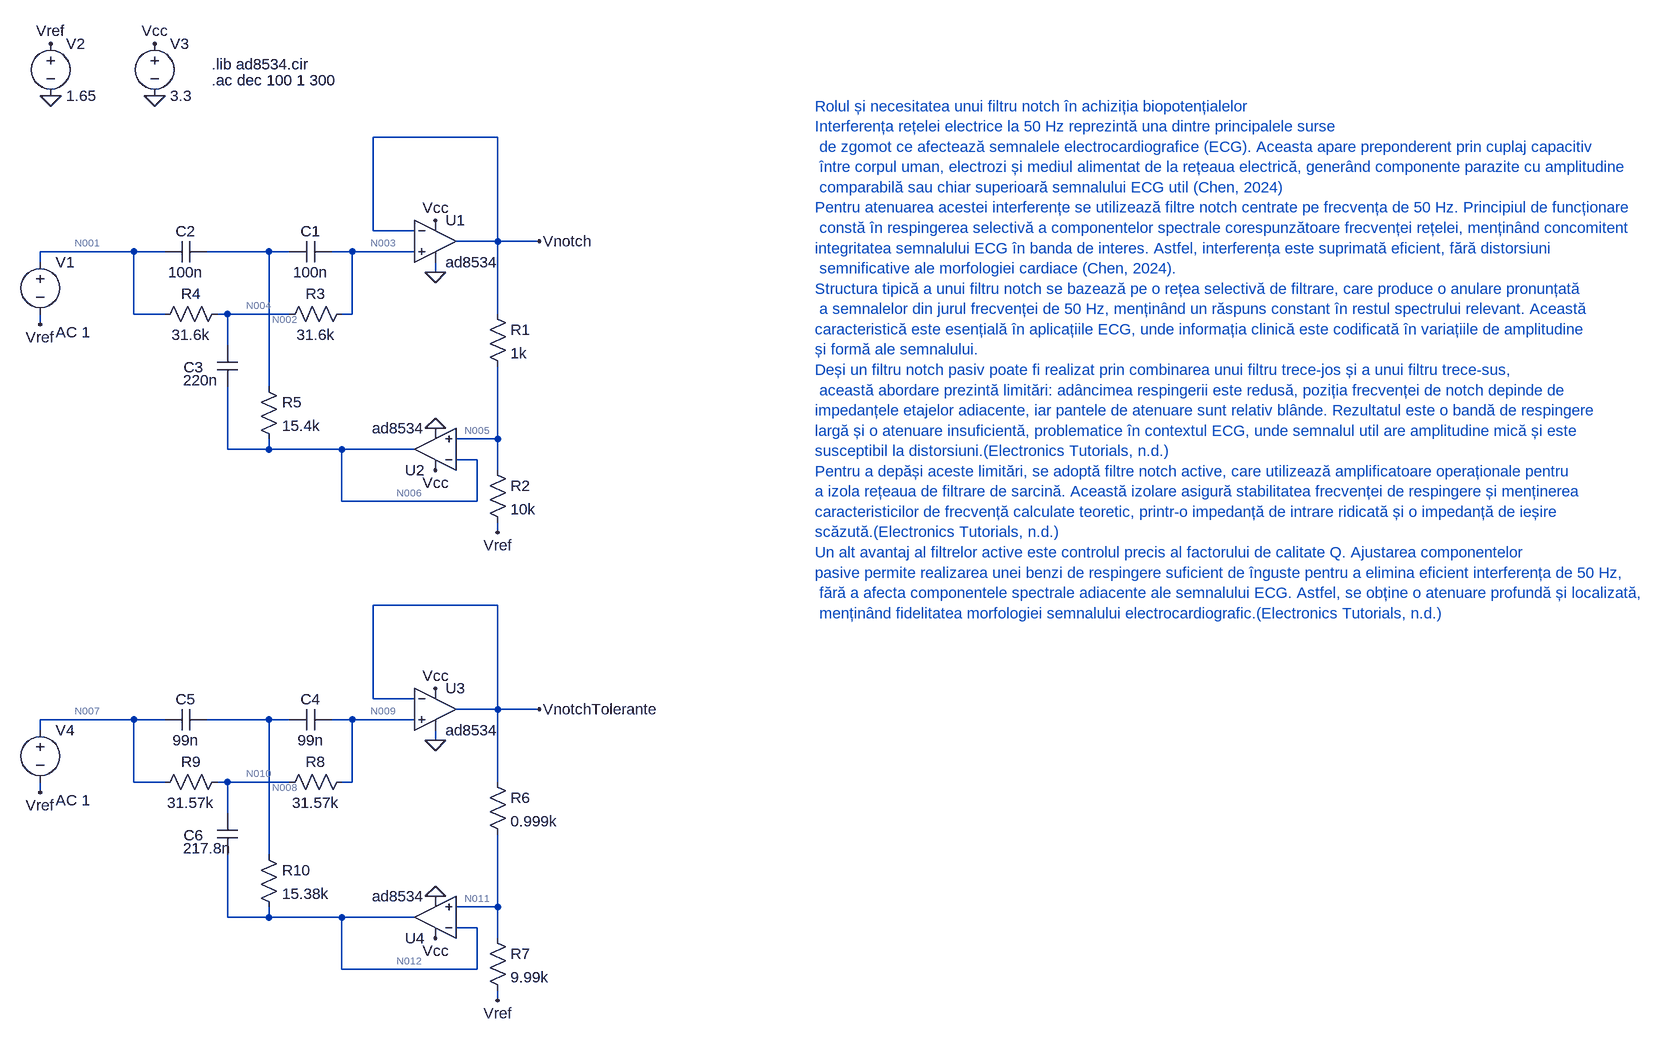
[diagram p0: schematic Notch.asc]
Notch.asc, the LTspice schematic file:
Version 4.1
SHEET 1 2208 1344
WIRE 512 -64 320 -64
WIRE 320 80 320 -64
WIRE 384 80 320 80
WIRE 512 96 512 -64
WIRE 512 96 448 96
WIRE 576 96 512 96
WIRE -48 112 -192 112
WIRE 0 112 -48 112
WIRE 160 112 64 112
WIRE 192 112 160 112
WIRE 288 112 256 112
WIRE 384 112 288 112
WIRE -192 128 -192 112
WIRE 416 144 416 128
WIRE -48 208 -48 112
WIRE 0 208 -48 208
WIRE 96 208 80 208
WIRE 192 208 96 208
WIRE 288 208 288 112
WIRE 288 208 272 208
WIRE 512 208 512 96
WIRE -192 224 -192 208
WIRE 96 256 96 208
WIRE 160 320 160 112
WIRE 512 400 512 288
WIRE 512 400 448 400
WIRE 96 416 96 320
WIRE 160 416 160 400
WIRE 160 416 96 416
WIRE 272 416 160 416
WIRE 384 416 272 416
WIRE 480 432 448 432
WIRE 512 448 512 400
WIRE 272 496 272 416
WIRE 480 496 480 432
WIRE 480 496 272 496
WIRE 512 544 512 528
WIRE 512 656 320 656
WIRE 320 800 320 656
WIRE 384 800 320 800
WIRE 512 816 512 656
WIRE 512 816 448 816
WIRE 576 816 512 816
WIRE -48 832 -192 832
WIRE 0 832 -48 832
WIRE 160 832 64 832
WIRE 192 832 160 832
WIRE 288 832 256 832
WIRE 384 832 288 832
WIRE -192 848 -192 832
WIRE 416 864 416 848
WIRE -48 928 -48 832
WIRE 0 928 -48 928
WIRE 96 928 80 928
WIRE 192 928 96 928
WIRE 288 928 288 832
WIRE 288 928 272 928
WIRE 512 928 512 816
WIRE -192 944 -192 928
WIRE 96 976 96 928
WIRE 160 1040 160 832
WIRE 512 1120 512 1008
WIRE 512 1120 448 1120
WIRE 96 1136 96 1040
WIRE 160 1136 160 1120
WIRE 160 1136 96 1136
WIRE 272 1136 160 1136
WIRE 384 1136 272 1136
WIRE 480 1152 448 1152
WIRE 512 1168 512 1120
WIRE 272 1216 272 1136
WIRE 480 1216 480 1152
WIRE 480 1216 272 1216
WIRE 512 1264 512 1248
FLAG 416 144 0
FLAG 416 64 Vcc
FLAG 576 96 Vnotch
FLAG 416 448 Vcc
FLAG 416 384 0
FLAG -176 -208 Vref
FLAG -176 -128 0
FLAG -16 -128 0
FLAG -16 -208 Vcc
FLAG 512 544 Vref
FLAG -192 224 Vref
FLAG 416 864 0
FLAG 416 784 Vcc
FLAG 576 816 VnotchTolerante
FLAG 416 1168 Vcc
FLAG 416 1104 0
FLAG 512 1264 Vref
FLAG -192 944 Vref
SYMBOL OpAmps\\opamp2 416 32 R0
SYMATTR InstName U1
SYMATTR Value ad8534
SYMBOL res 496 192 R0
SYMATTR InstName R1
SYMATTR Value 1k
SYMBOL res 496 432 R0
SYMATTR InstName R2
SYMATTR Value 10k
SYMBOL cap 256 96 R90
WINDOW 0 0 32 VBottom 2
WINDOW 3 32 32 VTop 2
SYMATTR InstName C1
SYMATTR Value 100n
SYMBOL cap 64 96 R90
WINDOW 0 0 32 VBottom 2
WINDOW 3 32 32 VTop 2
SYMATTR InstName C2
SYMATTR Value 100n
SYMBOL res 288 192 R90
WINDOW 0 0 56 VBottom 2
WINDOW 3 32 56 VTop 2
SYMATTR InstName R3
SYMATTR Value 31.6k
SYMBOL res 96 192 R90
WINDOW 0 0 56 VBottom 2
WINDOW 3 32 56 VTop 2
SYMATTR InstName R4
SYMATTR Value 31.6k
SYMBOL cap 80 256 R0
WINDOW 0 -51 34 Left 2
WINDOW 3 -52 54 Left 2
SYMATTR InstName C3
SYMATTR Value 220n
SYMBOL res 144 304 R0
SYMATTR InstName R5
SYMATTR Value 15.4k
SYMBOL OpAmps\\opamp2 416 480 R180
SYMATTR InstName U2
SYMATTR Value ad8534
SYMBOL voltage -192 112 R0
WINDOW 123 24 124 Left 2
WINDOW 39 0 0 Left 0
SYMATTR Value2 AC 1
SYMATTR InstName V1
SYMATTR Value ""
SYMBOL voltage -176 -224 R0
WINDOW 123 0 0 Left 0
WINDOW 39 0 0 Left 0
SYMATTR InstName V2
SYMATTR Value 1.65
SYMBOL voltage -16 -224 R0
SYMATTR InstName V3
SYMATTR Value 3.3
SYMBOL OpAmps\\opamp2 416 752 R0
SYMATTR InstName U3
SYMATTR Value ad8534
SYMBOL res 496 912 R0
SYMATTR InstName R6
SYMATTR Value 0.999k
SYMBOL res 496 1152 R0
SYMATTR InstName R7
SYMATTR Value 9.99k
SYMBOL cap 256 816 R90
WINDOW 0 0 32 VBottom 2
WINDOW 3 32 32 VTop 2
SYMATTR InstName C4
SYMATTR Value 99n
SYMBOL cap 64 816 R90
WINDOW 0 0 32 VBottom 2
WINDOW 3 32 32 VTop 2
SYMATTR InstName C5
SYMATTR Value 99n
SYMBOL res 288 912 R90
WINDOW 0 0 56 VBottom 2
WINDOW 3 32 56 VTop 2
SYMATTR InstName R8
SYMATTR Value 31.57k
SYMBOL res 96 912 R90
WINDOW 0 0 56 VBottom 2
WINDOW 3 32 56 VTop 2
SYMATTR InstName R9
SYMATTR Value 31.57k
SYMBOL cap 80 976 R0
WINDOW 0 -51 34 Left 2
WINDOW 3 -52 54 Left 2
SYMATTR InstName C6
SYMATTR Value 217.8n
SYMBOL res 144 1024 R0
SYMATTR InstName R10
SYMATTR Value 15.38k
SYMBOL OpAmps\\opamp2 416 1200 R180
SYMATTR InstName U4
SYMATTR Value ad8534
SYMBOL voltage -192 832 R0
WINDOW 123 24 124 Left 2
WINDOW 39 0 0 Left 0
SYMATTR Value2 AC 1
SYMATTR InstName V4
SYMATTR Value ""
TEXT 72 -152 Left 2 !.ac dec 100 1 300
TEXT 72 -176 Left 2 !.lib ad8534.cir
TEXT 1000 -112 Left 2 ;Rolul și necesitatea unui filtru notch în achiziția biopotențialelor\nInterferența rețelei electrice la 50 Hz reprezintă una dintre principalele surse\n de zgomot ce afectează semnalele electrocardiografice (ECG). Aceasta apare preponderent prin cuplaj capacitiv\n între corpul uman, electrozi și mediul alimentat de la rețeaua electrică, generând componente parazite cu amplitudine\n comparabilă sau chiar superioară semnalului ECG util (Chen, 2024)\nPentru atenuarea acestei interferențe se utilizează filtre notch centrate pe frecvența de 50 Hz. Principiul de funcționare\n constă în respingerea selectivă a componentelor spectrale corespunzătoare frecvenței rețelei, menținând concomitent \nintegritatea semnalului ECG în banda de interes. Astfel, interferența este suprimată eficient, fără distorsiuni\n semnificative ale morfologiei cardiace (Chen, 2024).\nStructura tipică a unui filtru notch se bazează pe o rețea selectivă de filtrare, care produce o anulare pronunțată\n a semnalelor din jurul frecvenței de 50 Hz, menținând un răspuns constant în restul spectrului relevant. Această \ncaracteristică este esențială în aplicațiile ECG, unde informația clinică este codificată în variațiile de amplitudine \nși formă ale semnalului.\nDeși un filtru notch pasiv poate fi realizat prin combinarea unui filtru trece-jos și a unui filtru trece-sus,\n această abordare prezintă limitări: adâncimea respingerii este redusă, poziția frecvenței de notch depinde de \nimpedanțele etajelor adiacente, iar pantele de atenuare sunt relativ blânde. Rezultatul este o bandă de respingere \nlargă și o atenuare insuficientă, problematice în contextul ECG, unde semnalul util are amplitudine mică și este \nsusceptibil la distorsiuni.(Electronics Tutorials, n.d.)\nPentru a depăși aceste limitări, se adoptă filtre notch active, care utilizează amplificatoare operaționale pentru \na izola rețeaua de filtrare de sarcină. Această izolare asigură stabilitatea frecvenței de respingere și menținerea \ncaracteristicilor de frecvență calculate teoretic, printr-o impedanță de intrare ridicată și o impedanță de ieșire \nscăzută.(Electronics Tutorials, n.d.)\nUn alt avantaj al filtrelor active este controlul precis al factorului de calitate Q. Ajustarea componentelor \npasive permite realizarea unei benzi de respingere suficient de înguste pentru a elimina eficient interferența de 50 Hz,\n fără a afecta componentele spectrale adiacente ale semnalului ECG. Astfel, se obține o atenuare profundă și localizată,\n menținând fidelitatea morfologiei semnalului electrocardiografic.(Electronics Tutorials, n.d.)

The netlist it stands for:
* Notch.asc
X§U1 N003 Vnotch Vcc 0 Vnotch ad8534  ; pins In+ In- V+ V- OUT
R1 Vnotch N005 1k
R2 N005 Vref 10k
C1 N003 N002 100n
C2 N002 N001 100n
R3 N003 N004 31.6k
R4 N004 N001 31.6k
C3 N004 N006 220n
R5 N002 N006 15.4k
X§U2 N005 N006 Vcc 0 N006 ad8534  ; pins In+ In- V+ V- OUT
V1 N001 Vref AC 1
V2 Vref 0 1.65
V3 Vcc 0 3.3
X§U3 N009 VnotchTolerante Vcc 0 VnotchTolerante ad8534  ; pins In+ In- V+ V- OUT
R6 VnotchTolerante N011 0.999k
R7 N011 Vref 9.99k
C4 N009 N008 99n
C5 N008 N007 99n
R8 N009 N010 31.57k
R9 N010 N007 31.57k
C6 N010 N012 217.8n
R10 N008 N012 15.38k
X§U4 N011 N012 Vcc 0 N012 ad8534  ; pins In+ In- V+ V- OUT
V4 N007 Vref AC 1
.ac dec 100 1 300
.lib ad8534.cir
* Rolul și necesitatea unui filtru notch în achiziția biopotențialelor
* Interferența rețelei electrice la 50 Hz reprezintă una dintre principalele surse
*  de zgomot ce afectează semnalele electrocardiografice (ECG). Aceasta apare preponderent prin cuplaj capacitiv
*  între corpul uman, electrozi și mediul alimentat de la rețeaua electrică, generând componente parazite cu amplitudine
*  comparabilă sau chiar superioară semnalului ECG util (Chen, 2024)
* Pentru atenuarea acestei interferențe se utilizează filtre notch centrate pe frecvența de 50 Hz. Principiul de funcționare
*  constă în respingerea selectivă a componentelor spectrale corespunzătoare frecvenței rețelei, menținând concomitent
* integritatea semnalului ECG în banda de interes. Astfel, interferența este suprimată eficient, fără distorsiuni
*  semnificative ale morfologiei cardiace (Chen, 2024).
* Structura tipică a unui filtru notch se bazează pe o rețea selectivă de filtrare, care produce o anulare pronunțată
*  a semnalelor din jurul frecvenței de 50 Hz, menținând un răspuns constant în restul spectrului relevant. Această
* caracteristică este esențială în aplicațiile ECG, unde informația clinică este codificată în variațiile de amplitudine
* și formă ale semnalului.
* Deși un filtru notch pasiv poate fi realizat prin combinarea unui filtru trece-jos și a unui filtru trece-sus,
*  această abordare prezintă limitări: adâncimea respingerii este redusă, poziția frecvenței de notch depinde de
* impedanțele etajelor adiacente, iar pantele de atenuare sunt relativ blânde. Rezultatul este o bandă de respingere
* largă și o atenuare insuficientă, problematice în contextul ECG, unde semnalul util are amplitudine mică și este
* susceptibil la distorsiuni.(Electronics Tutorials, n.d.)
* Pentru a depăși aceste limitări, se adoptă filtre notch active, care utilizează amplificatoare operaționale pentru
* a izola rețeaua de filtrare de sarcină. Această izolare asigură stabilitatea frecvenței de respingere și menținerea
* caracteristicilor de frecvență calculate teoretic, printr-o impedanță de intrare ridicată și o impedanță de ieșire
* scăzută.(Electronics Tutorials, n.d.)
* Un alt avantaj al filtrelor active este controlul precis al factorului de calitate Q. Ajustarea componentelor
* pasive permite realizarea unei benzi de respingere suficient de înguste pentru a elimina eficient interferența de 50 Hz,
*  fără a afecta componentele spectrale adiacente ale semnalului ECG. Astfel, se obține o atenuare profundă și localizată,
*  menținând fidelitatea morfologiei semnalului electrocardiografic.(Electronics Tutorials, n.d.)
.backanno
.end

* Results of the author's LTspice run, read from the files saved beside the schematic
* Operating Point, zero values left out:
*   V(n001) = 1.65 V
*   V(n002) = 1.66 V
*   V(n003) = 1.65 V
*   V(n004) = 1.65 V
*   V(n005) = 1.655 V
*   V(n006) = 1.66 V
*   V(n007) = 1.65 V
*   V(n008) = 1.66 V
*   V(n009) = 1.65 V
*   V(n010) = 1.65 V
*   V(n011) = 1.655 V
*   V(n012) = 1.66 V
*   V(vcc) = 3.3 V
*   V(vnotch) = 1.655 V
*   V(vnotchtolerante) = 1.655 V
*   V(vref) = 1.65 V
*   I(R1) = 455.5 nA
*   I(R2) = 455.5 nA
*   I(R3) = -4.5 pA
*   I(R4) = -4.5 pA
*   I(R6) = 456 nA
*   I(R7) = 456 nA
*   I(R8) = -4.5 pA
*   I(R9) = -4.5 pA
*   I(V1) = -4.5 pA
*   I(V2) = 911.5 nA
*   I(V3) = -2.347 mA
*   I(V4) = -4.5 pA
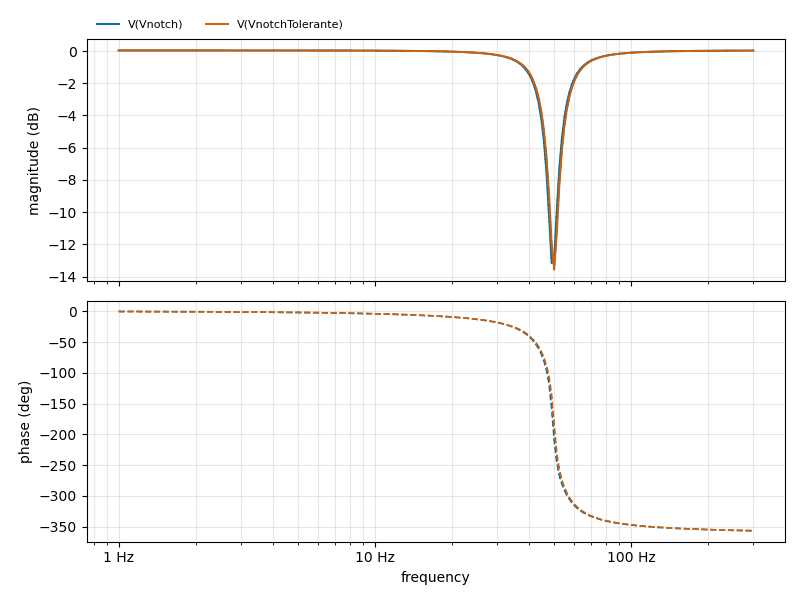
[diagram p1: AC Analysis of Notch.asc, plotted from the saved traces]
* AC Analysis, 1 run:
*   V(Vnotch): 0.04 dB at 1 Hz, 0.03 dB at 300 Hz, peak 0.04 dB at 1 Hz, 3 dB below the peak at 43.2 Hz
*   V(VnotchTolerante): 0.04 dB at 1 Hz, 0.03 dB at 300 Hz, peak 0.04 dB at 1 Hz, 3 dB below the peak at 43.71 Hz